# Altium schematic sheet 3_Communication.SchDoc: Communication
size A4; DrawnBy: Cristian Oprea; Revision: 1; SheetNumber: 3; SheetTotal: 4
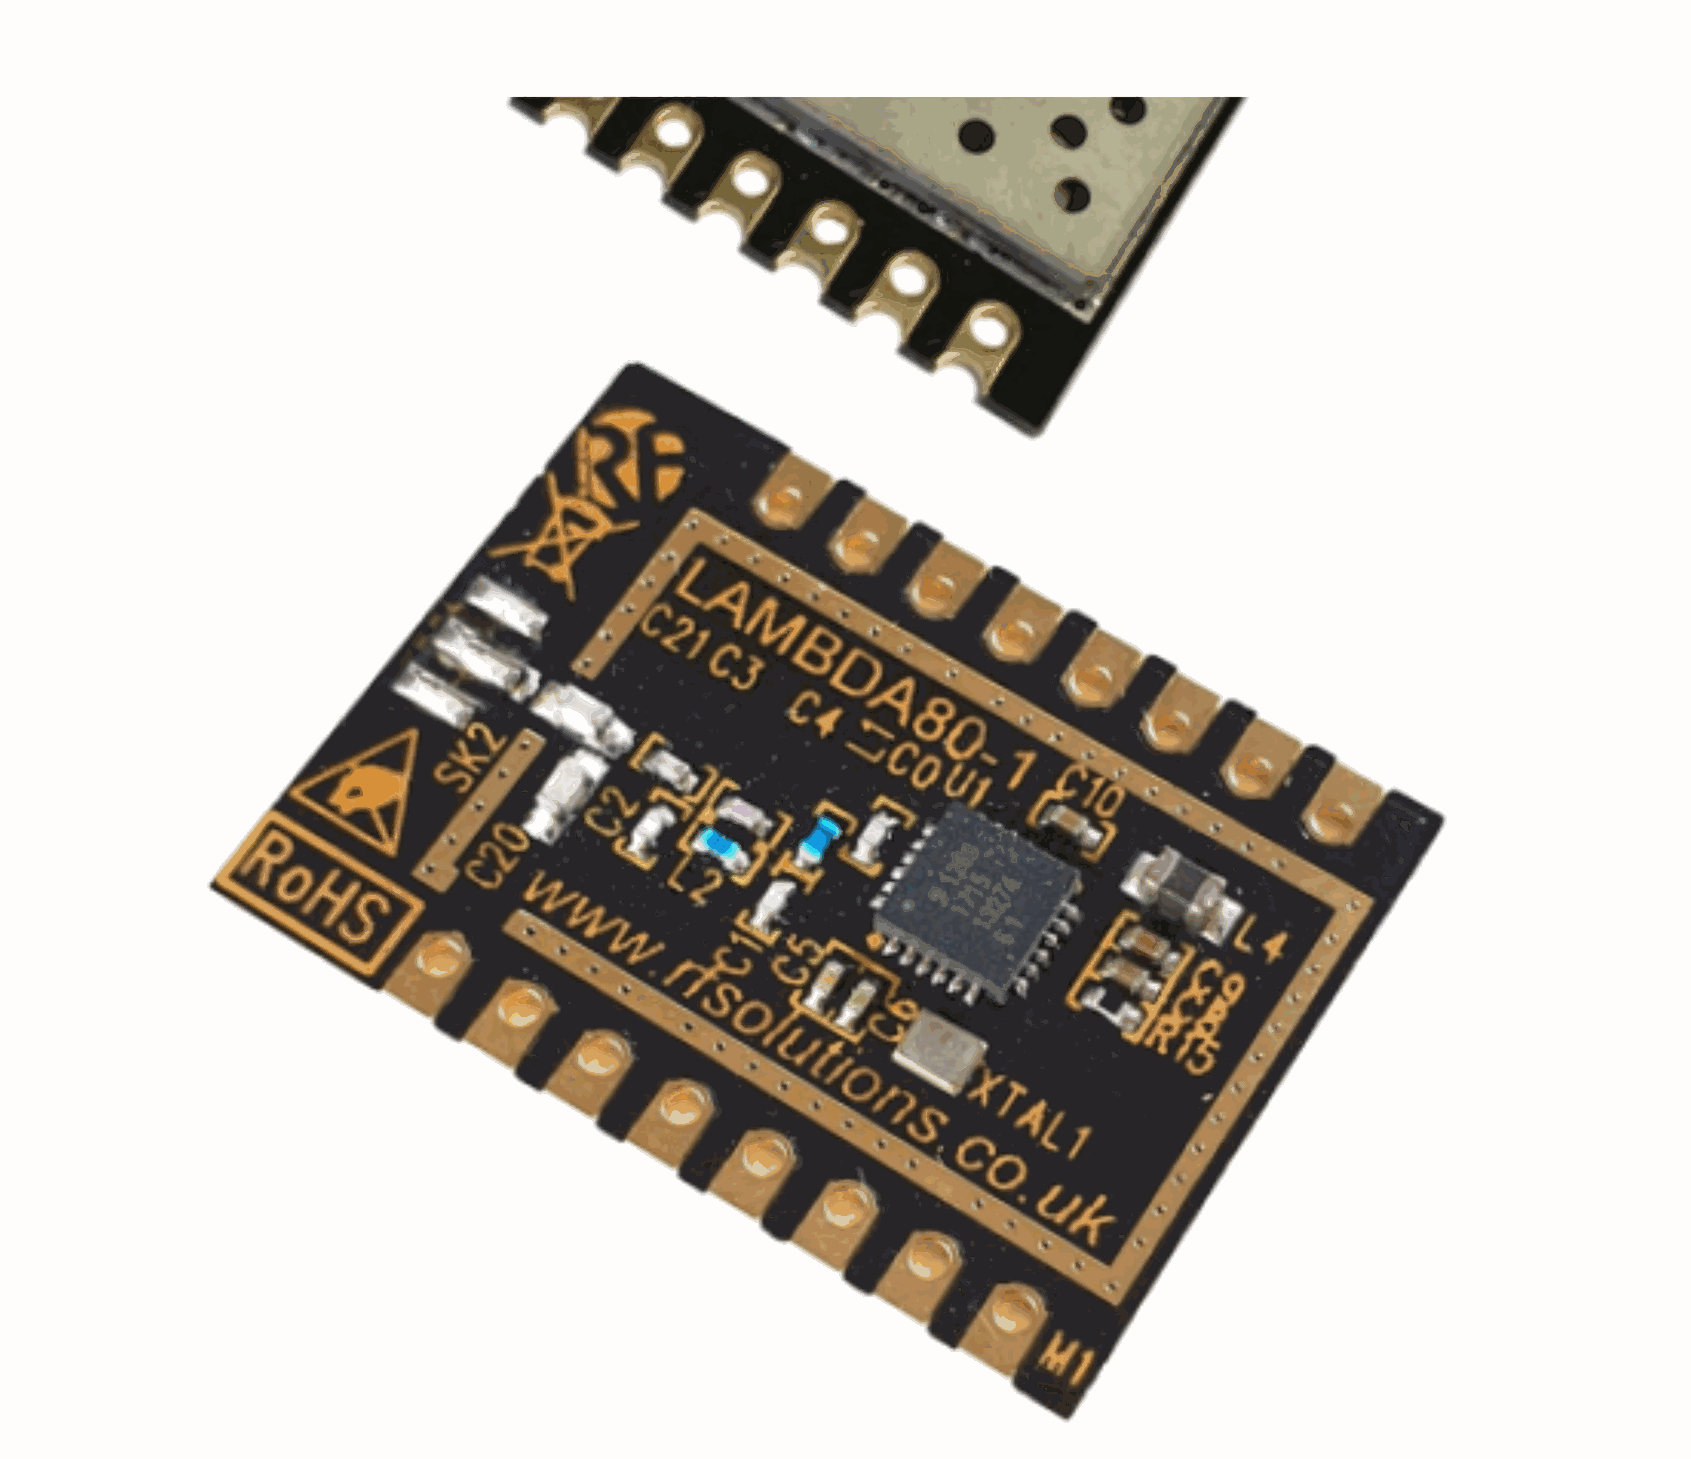
[diagram p0: 3_Communication.SchDoc, top middle]
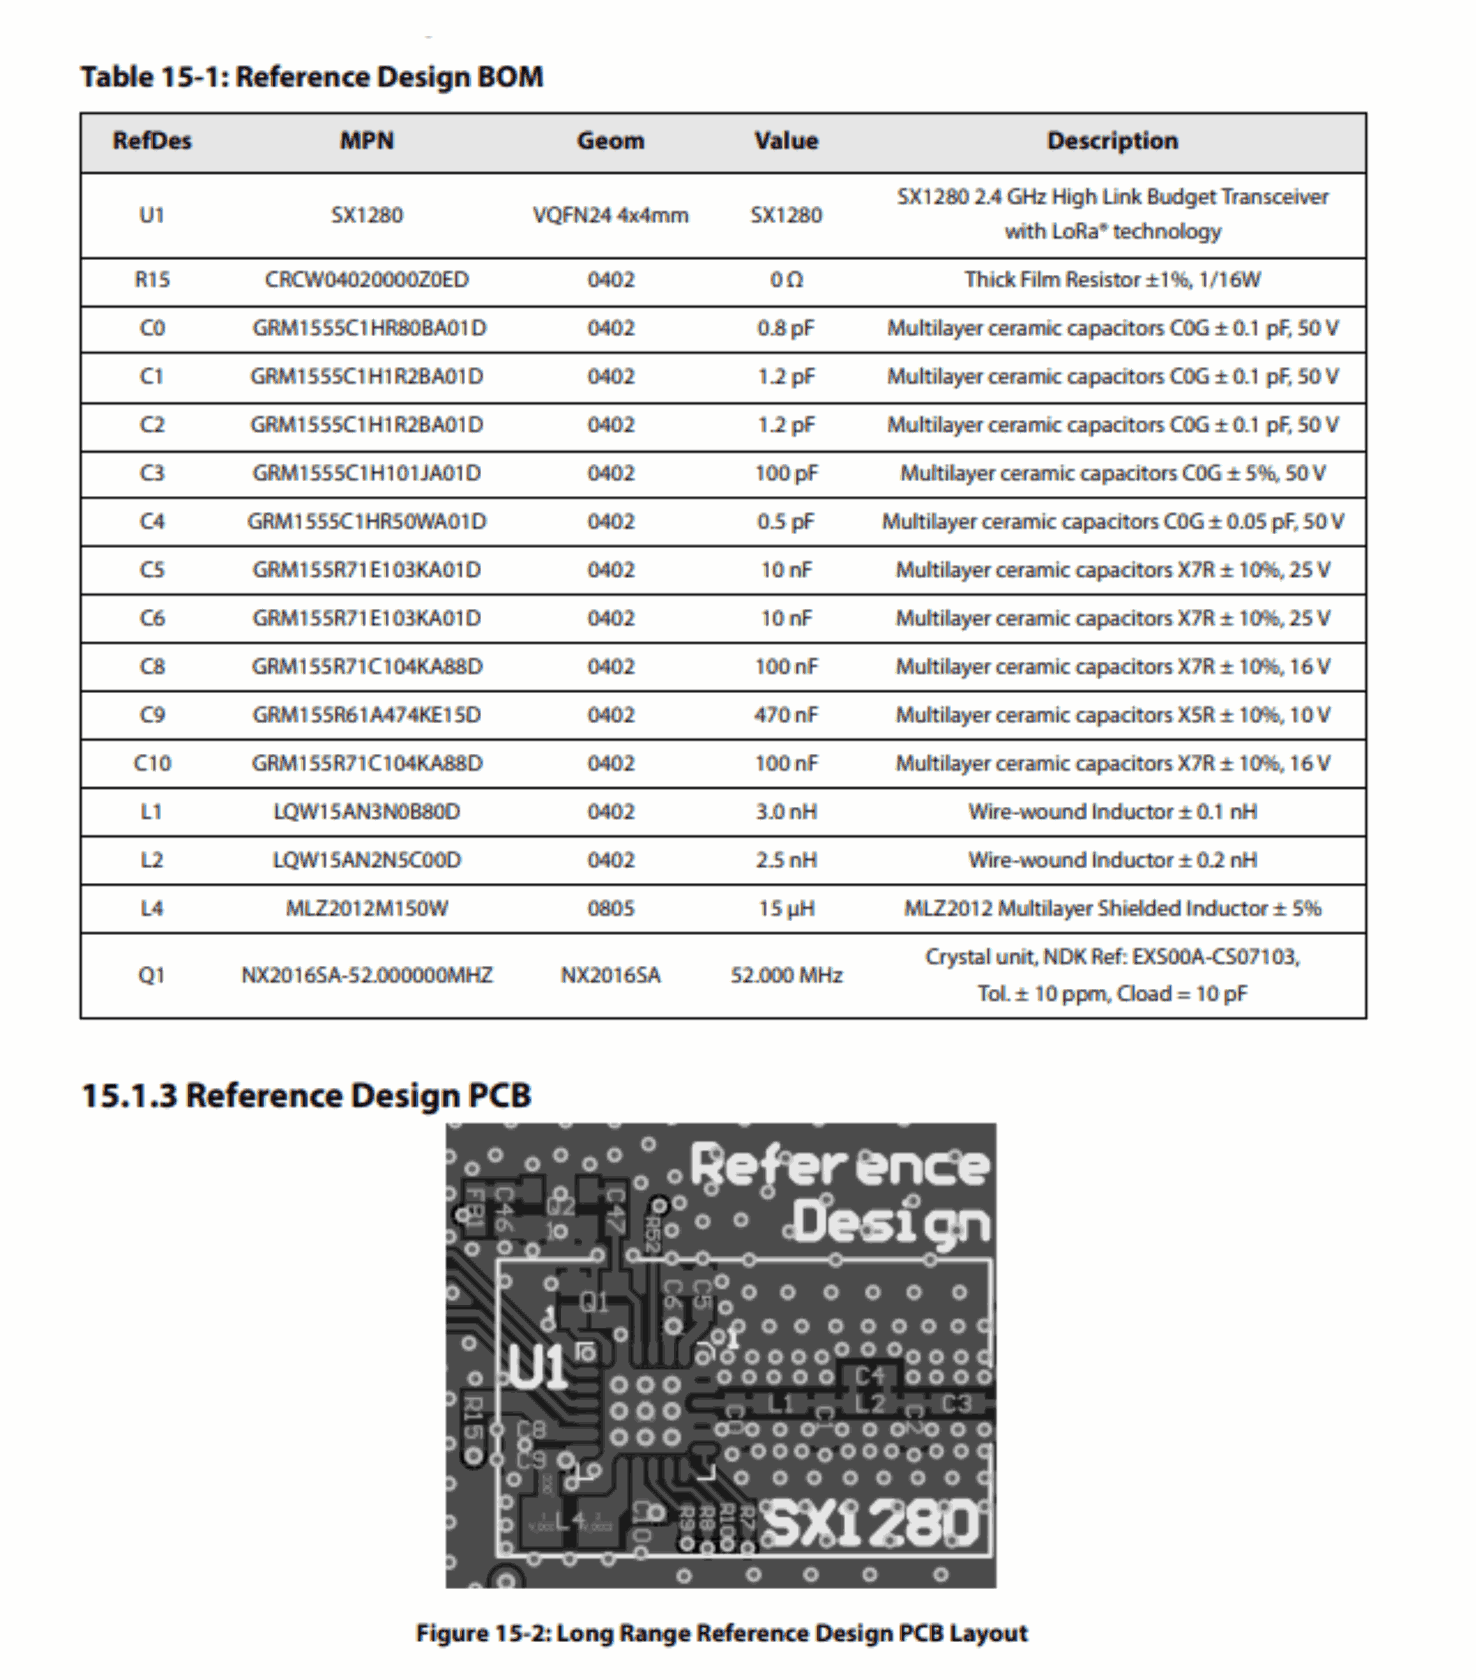
[diagram p1: 3_Communication.SchDoc, top right]
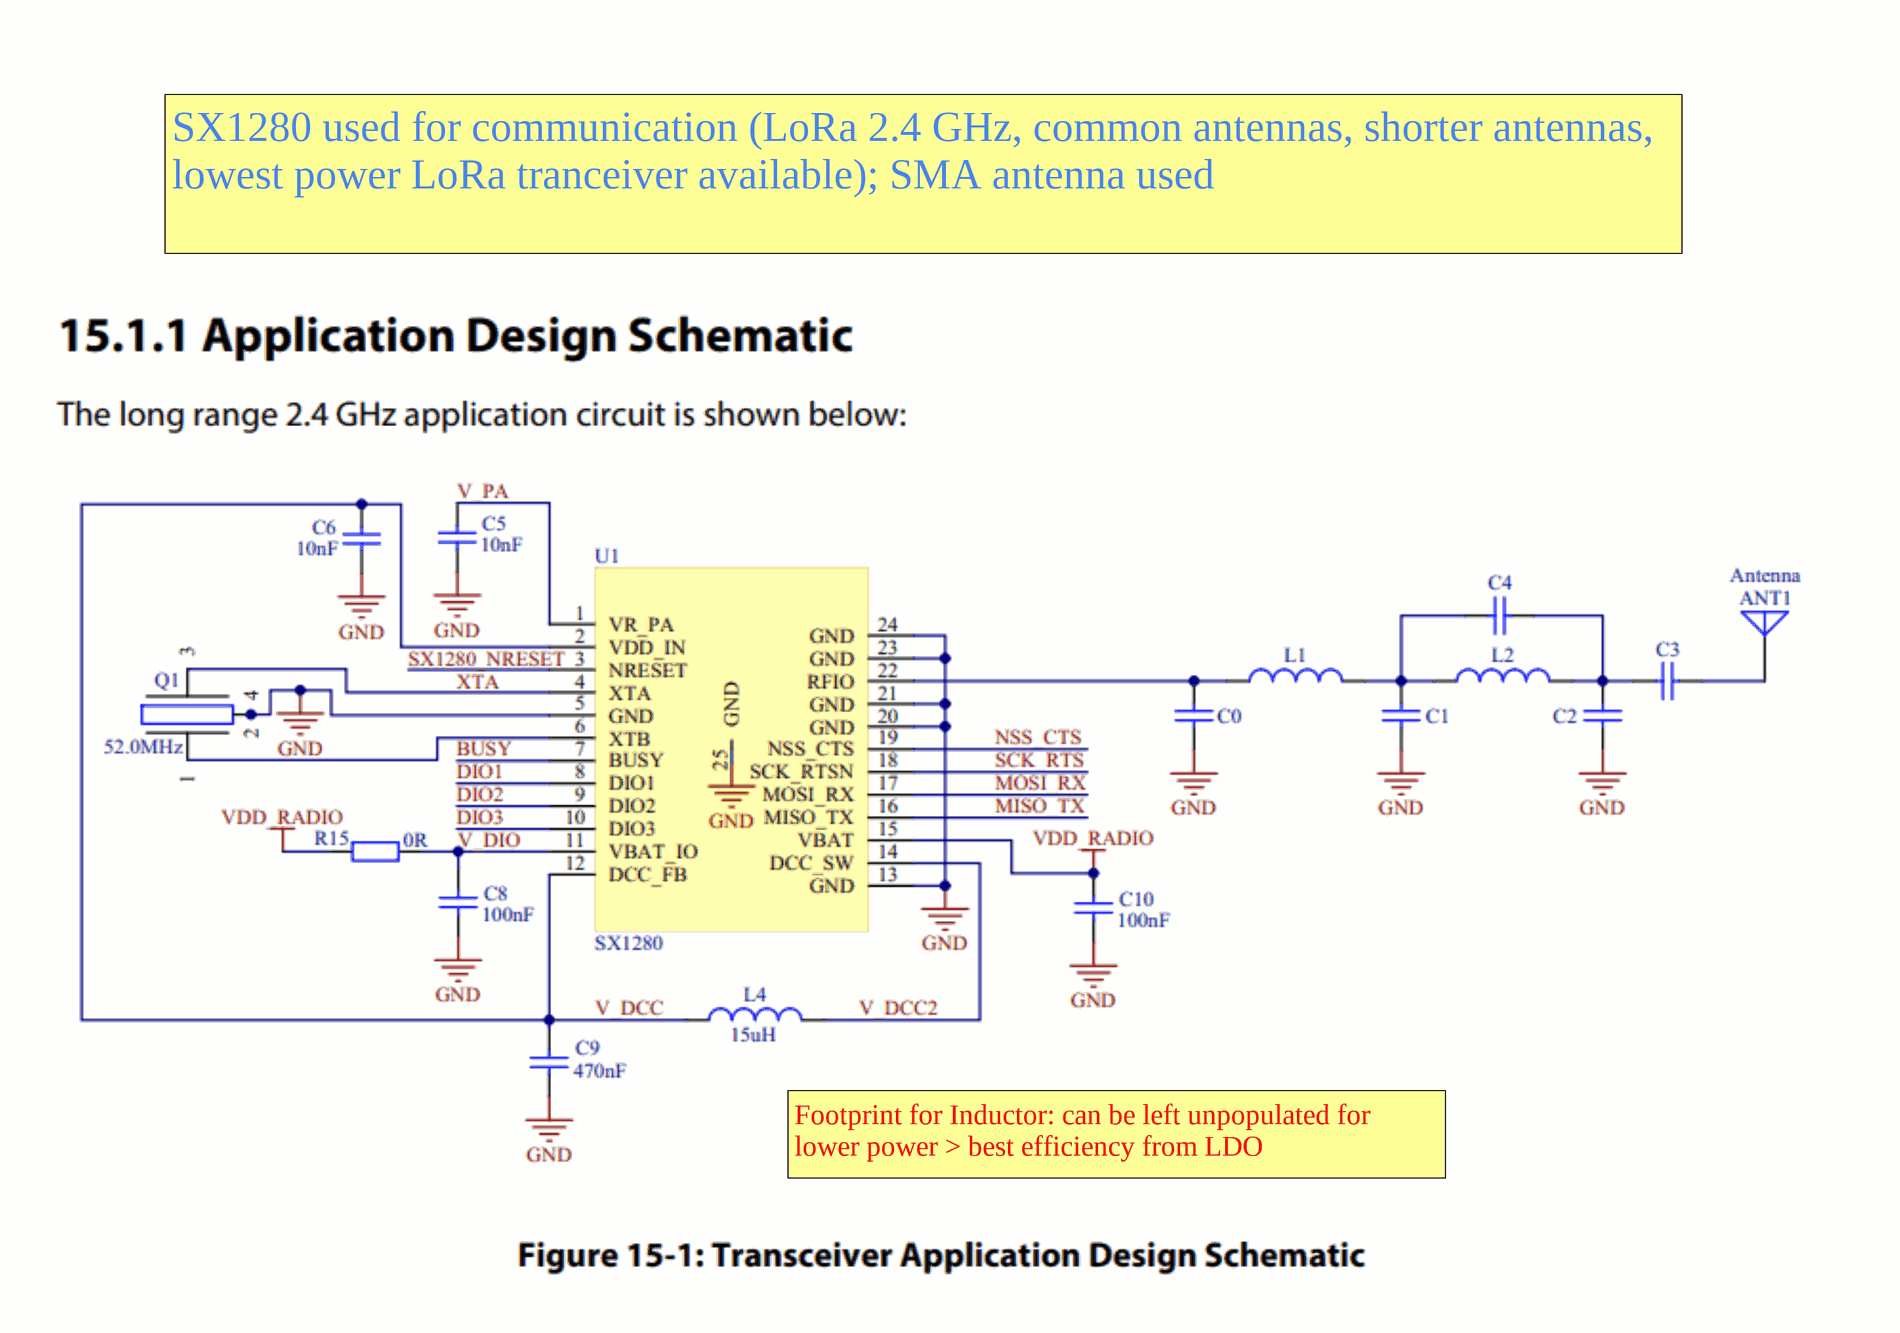
[diagram p2: 3_Communication.SchDoc, bottom left]
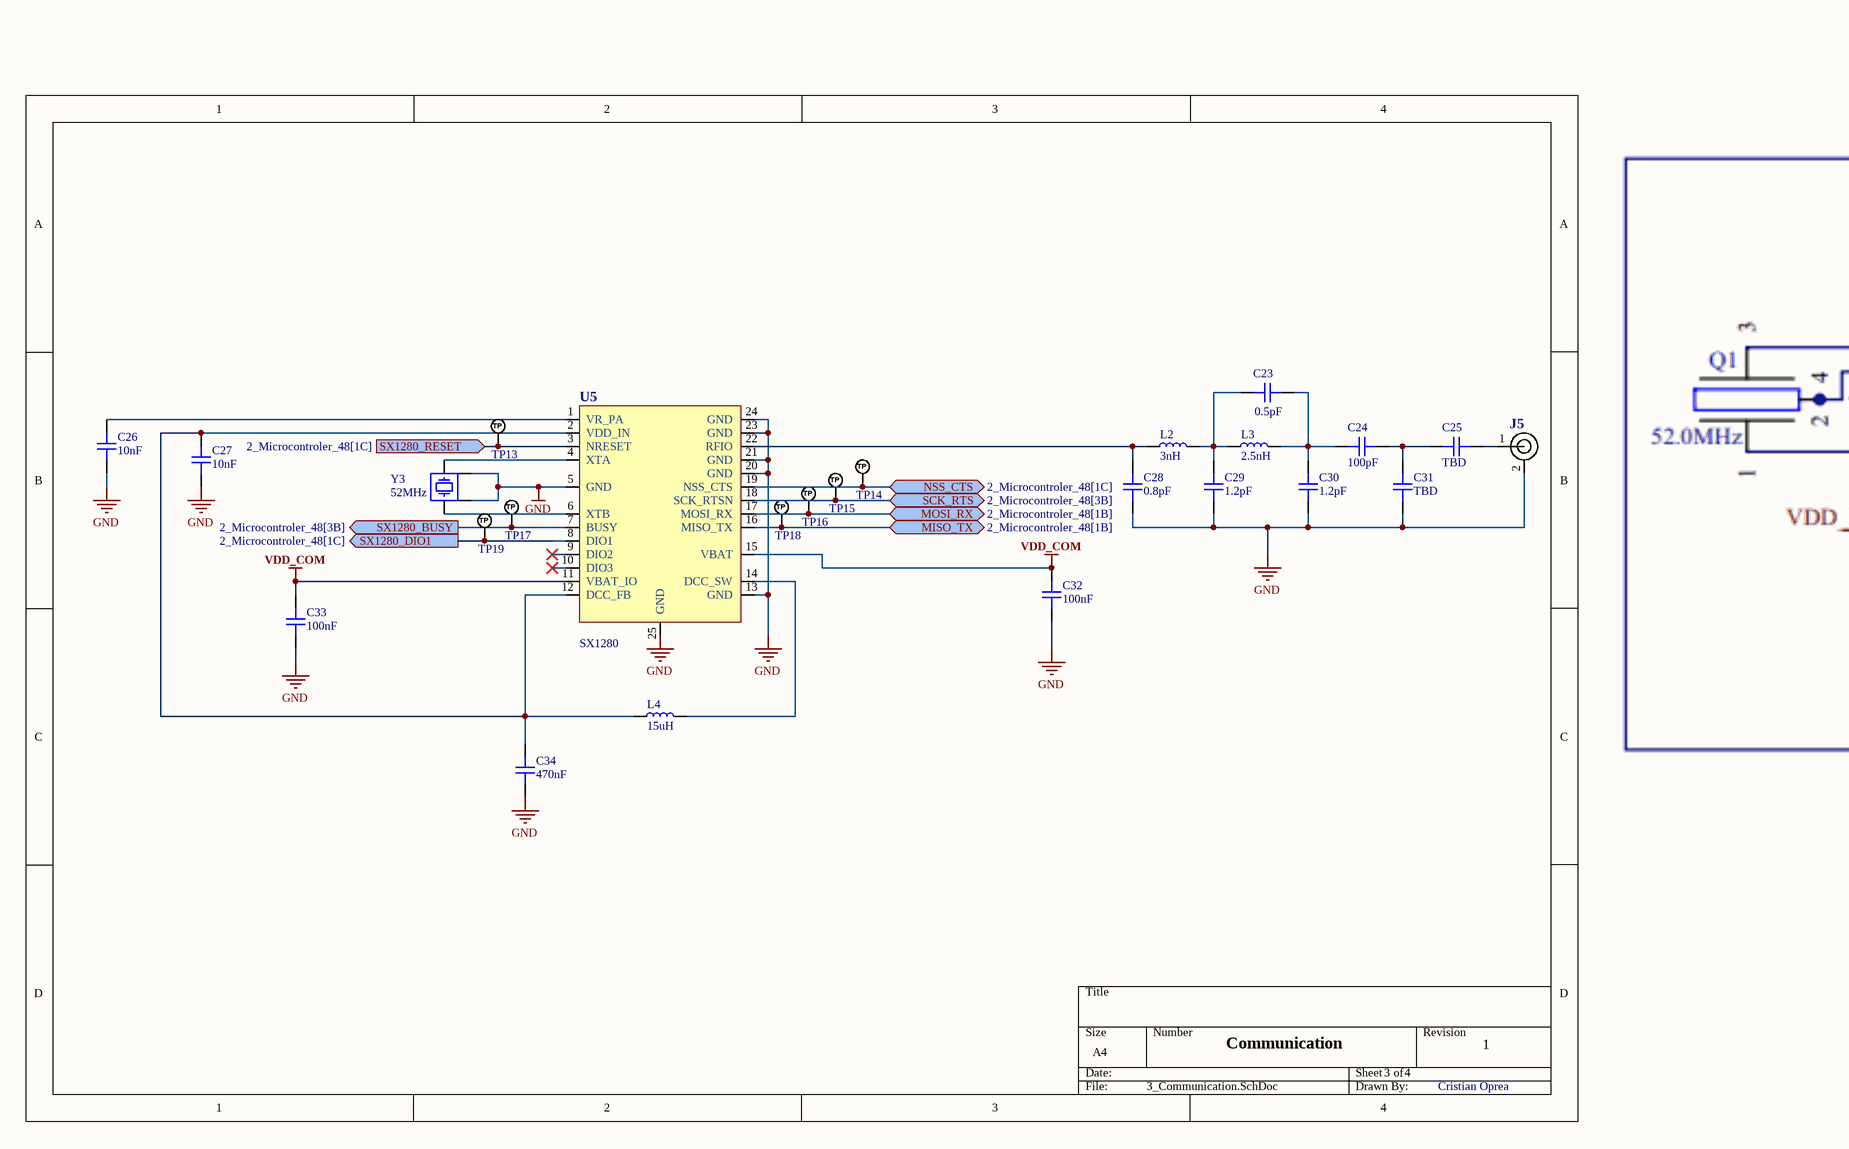
[diagram p3: 3_Communication.SchDoc, bottom middle]
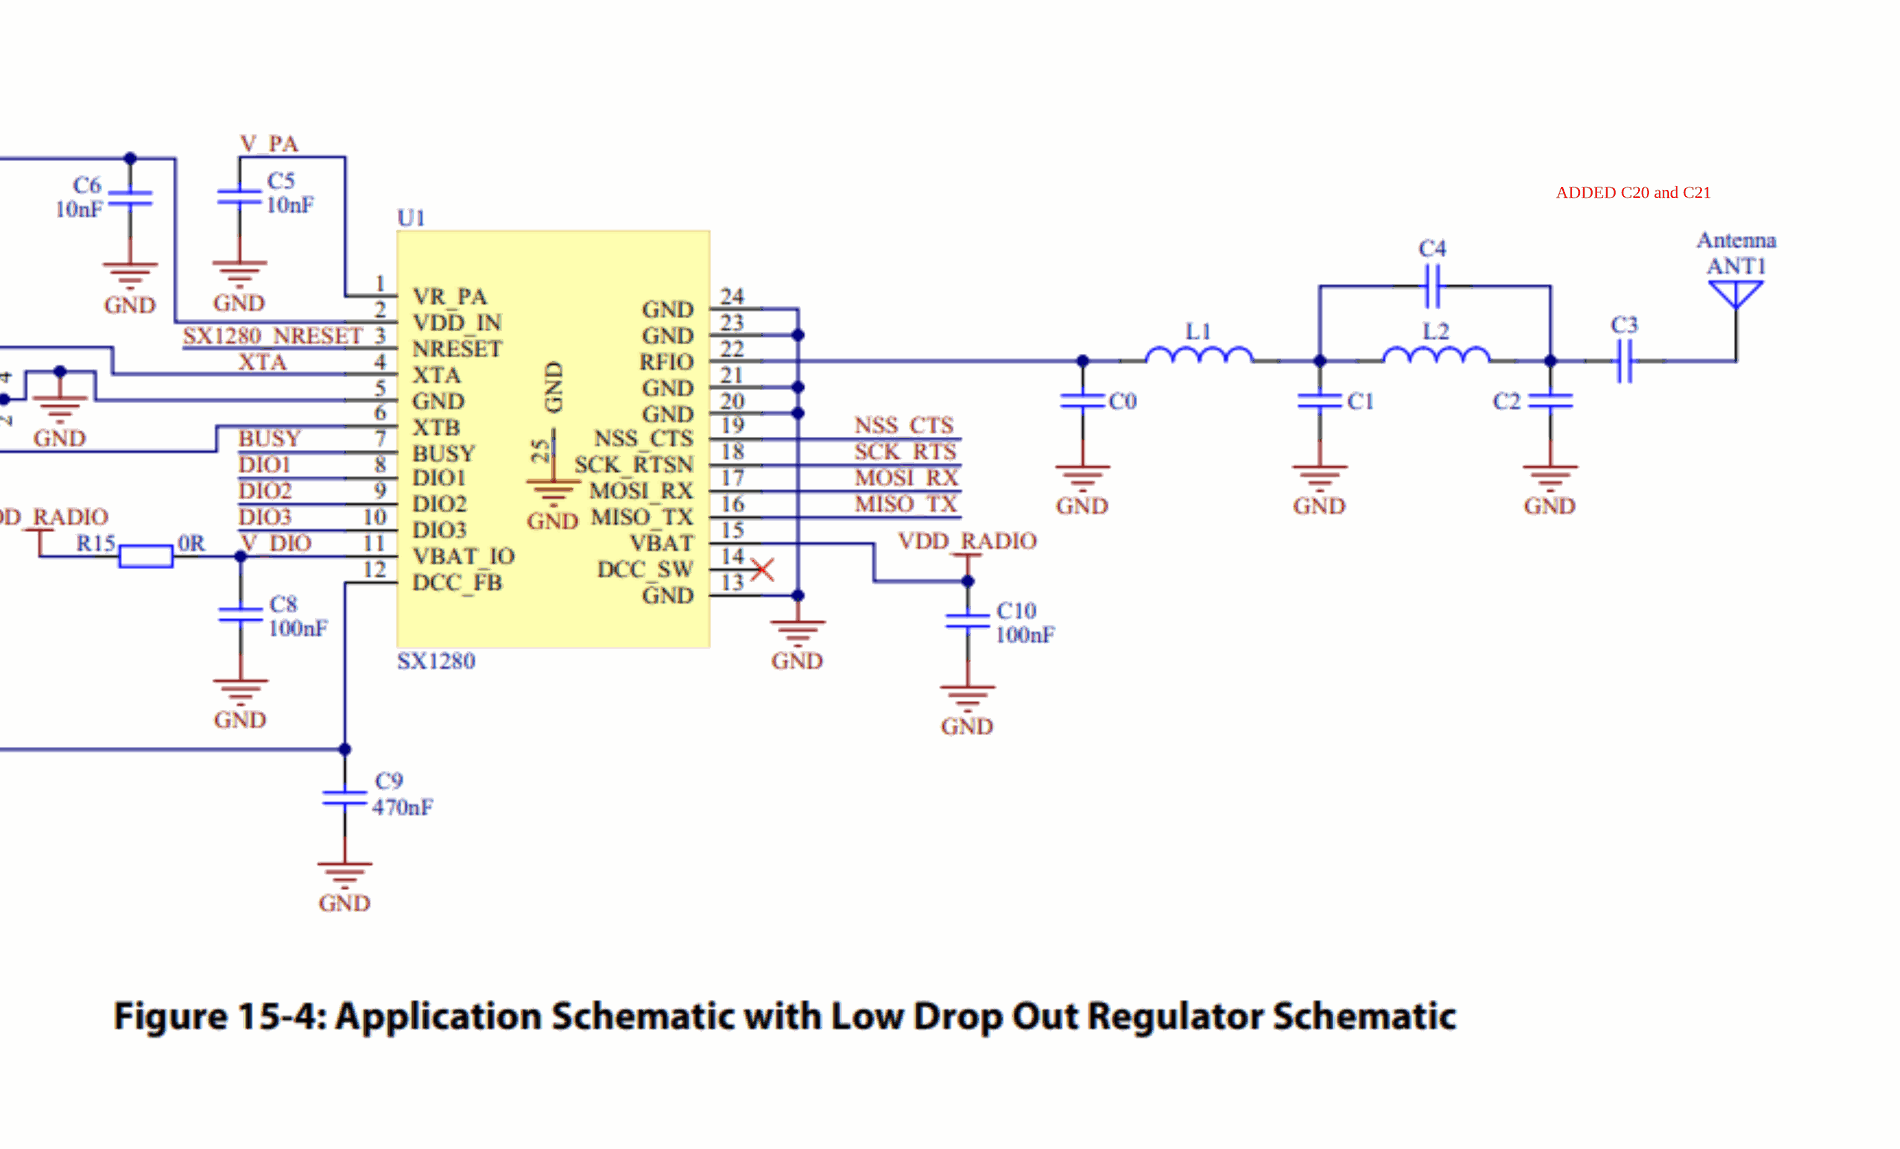
[diagram p4: 3_Communication.SchDoc, bottom right]

## Parts
C23  0.5pF  [C0603]
C24  100pF  [C0603]
C25  TBD  [C0805]
C26  10nF  [C0603]
C27  10nF  [C0603]
C28  0.8pF  [C0603]
C29  1.2pF  [C0603]
C30  1.2pF  [C0603]
C31  TBD  [C0805]
C32  100nF  [C0603]
C33  100nF  [C0603]
C34  470nF  [C0603]
J5  SMA_EDGE_CONN  [CON_SMA-EDGE-S]  (value not drawn)
L2  3nH  [R0603]
L3  2.5nH  [R0603]
L4  15uH  [IND_3.2_4]
TP13  TP_NOBOM  [TEST_PAD_THD]  (value not drawn)  (no BOM)
TP14  TP_NOBOM  [TEST_PAD_THD]  (value not drawn)  (no BOM)
TP15  TP_NOBOM  [TEST_PAD_THD]  (value not drawn)  (no BOM)
TP16  TP_NOBOM  [TEST_PAD_THD]  (value not drawn)  (no BOM)
TP17  TP_NOBOM  [TEST_PAD_THD]  (value not drawn)  (no BOM)
TP18  TP_NOBOM  [TEST_PAD_THD]  (value not drawn)  (no BOM)
TP19  TP_NOBOM  [TEST_PAD_THD]  (value not drawn)  (no BOM)
U5  SX1280  [QFN-24_4x4_0.5]
Y3  52MHz  [CRYSTAL_2016_4P]

## Ports
MISO_TX (bidir, see 2_Microcontroler_48[1B]), MOSI_RX (bidir, see 2_Microcontroler_48[1B]), NSS_CTS (bidir, see 2_Microcontroler_48[1C]), SCK_RTS (bidir, see 2_Microcontroler_48[3B]), SX1280_BUSY (out, see 2_Microcontroler_48[3B]), SX1280_DIO1 (out, see 2_Microcontroler_48[1C]), SX1280_RESET (in, see 2_Microcontroler_48[1C])

## Nets
GND: C26.1 C27.1 C28.1 C29.1 C30.1 C31.1 C32.1 C33.1 C34.1 J5.2 U5.5(GND) U5.13(GND) U5.20(GND) U5.21(GND) U5.23(GND) U5.24(GND) U5.25(GND) Y3.2 Y3.4
VDD_COM: C32.2 C33.2 U5.11(VBAT_IO) U5.15(VBAT)
MISO_TX: TP18.1(TP) U5.16(MISO_TX) ; port MISO_TX
MOSI_RX: TP16.1(TP) U5.17(MOSI_RX) ; port MOSI_RX
NSS_CTS: TP14.1(TP) U5.19(NSS_CTS) ; port NSS_CTS
SCK_RTS: TP15.1(TP) U5.18(SCK_RTSN) ; port SCK_RTS
SX1280_BUSY: TP17.1(TP) U5.7(BUSY) ; port SX1280_BUSY
SX1280_DIO1: TP19.1(TP) U5.8(DIO1) ; port SX1280_DIO1
SX1280_RESET: TP13.1(TP) U5.3(NRESET) ; port SX1280_RESET
NetC23_1: C23.1 C24.2 C30.2 L3.2
NetC23_2: C23.2 C29.2 L2.2 L3.1
NetC24_1: C24.1 C25.2 C31.2
NetC25_1: C25.1 J5.1
NetC26_2: C26.2 U5.1(VR_PA)
NetC27_2: C27.2 C34.2 L4.1 U5.2(VDD_IN) U5.12(DCC_FB)
NetC28_2: C28.2 L2.1 U5.22(RFIO)
NetL4_2: L4.2 U5.14(DCC_SW)
NetU5_4: U5.4(XTA) Y3.3
NetU5_6: U5.6(XTB) Y3.1

Not connected (* = marked no-connect by the designer): U5 9(DIO2)* 10(DIO3)*

## Notes on the sheet
- SX1280 used for communication (LoRa 2.4 GHz, common antennas, shorter antennas, lowest power LoRa tranceiver available); SMA antenna used
- ADDED C20 and C21
- impedance matching configurations(40R to 50R after C25)
- (near J5) Values based on antenna input impedance; capacitors to ground can be left unpopullated, inductors or series capacitors can be swaped with 0R resistors or shunts
- (near J5) last 2 capacitors are for impedance matching for certain antenna
- Footprint for Inductor: can be left unpopulated for lower power > best efficiency from LDO

## Library data of the parts
C23 C24 C26-C30 C32-C34 = CAP_0603: Capacitor SMD 0603; Manufacturer: *; Manufacturer Part Number: *; Distributor Link: *; LCSC: *; Rating: *; Dielectric: *
C25 C31 = CAP_0603: Capacitor SMD 0805; Manufacturer: *; Manufacturer Part Number: *; Distributor Link: *; LCSC: *; Rating: *; Dielectric: *
J5 = CON-SMA-EDGE-S: RF Connector SMA Female 50 Ohms 18 GHz PCB Edge Mount; Manufacturer: RF Solutions; Manufacturer Part Number: CON-SMA-EDGE-S
L2-L4 = IND_0603: Inductor SMD 0603
TP13-TP19 = TEST_POINT_RND_1MM: Test Point Round 1mm (NO BOM)
U5 = SX1280: Low power LoRa transceiver operating at 2.4GHz with ranging capability
Y3 = Crystal: Manufacturer: Epson; Manufacturer Part Number: TSX-3225 24.0000MF15X-AC